# EAGLE design main_v2.0 (EAGLE 9.6.2)
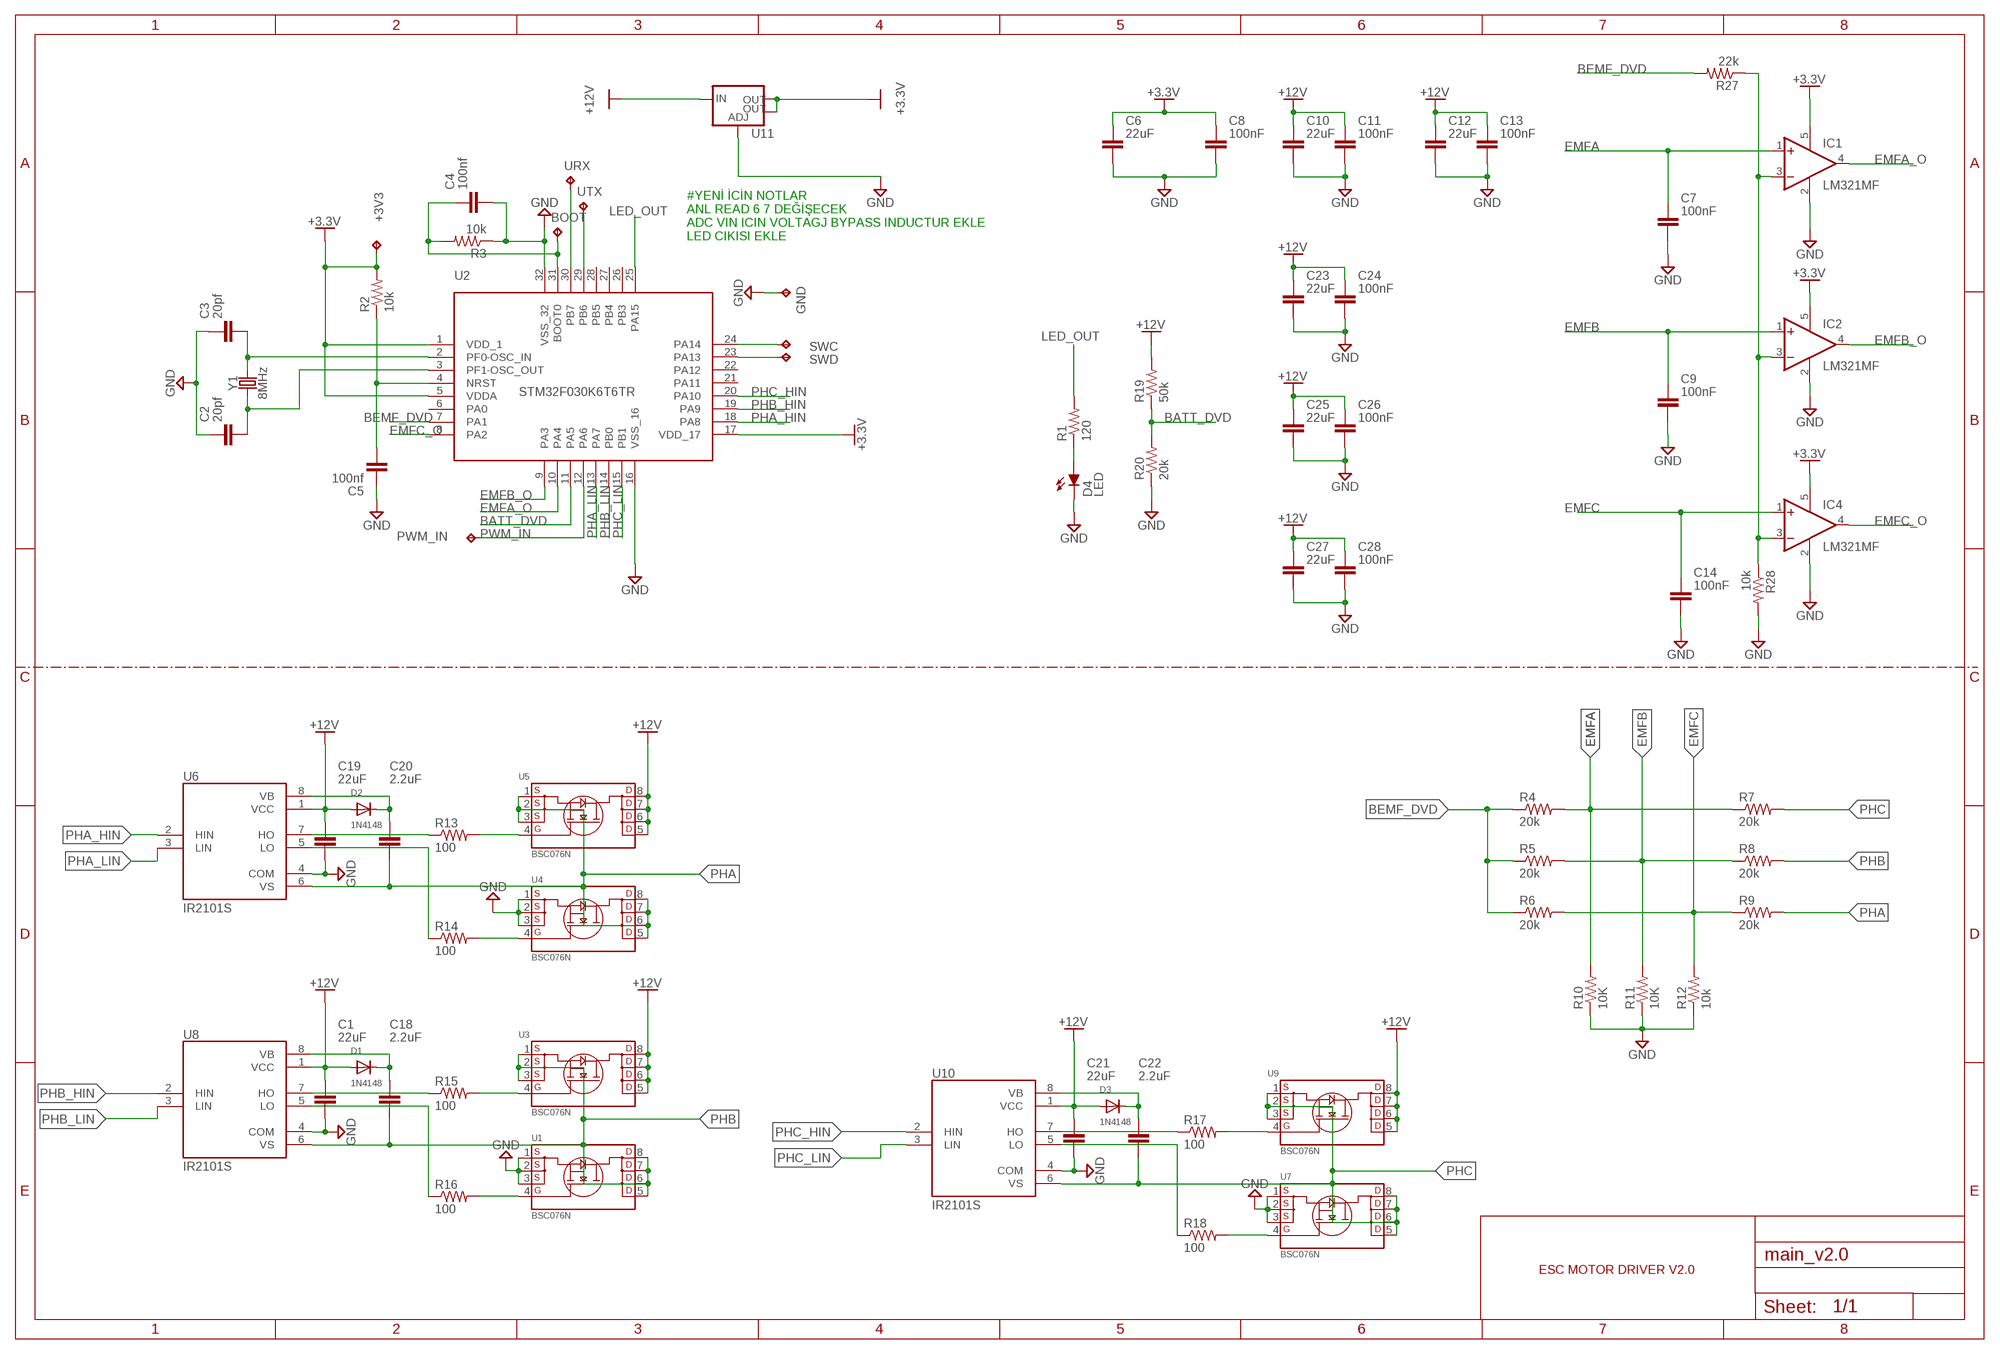
[diagram p0: schematic, sheet 1]

## Parts
+3V3  TPTP13R  [TP13R]
BOOT  TPTP13R  [TP13R]
C1  22uF  C_CHIP-1206(3216-METRIC)  [CAPC3216X135]
C2  20pf  C_CHIP-0603(1608-METRIC)  [CAPC1608X85]
C3  20pf  C_CHIP-0603(1608-METRIC)  [CAPC1608X85]
C4  100nf  C_CHIP-0805(2012-METRIC)  [CAPC2012X110]
C5  100nf  C_CHIP-0805(2012-METRIC)  [CAPC2012X110]
C6  22uF  C_CHIP-1206(3216-METRIC)  [CAPC3216X135]
C7  100nF  C_CHIP-0805(2012-METRIC)  [CAPC2012X110]
C8  100nF  C_CHIP-0805(2012-METRIC)  [CAPC2012X110]
C9  100nF  C_CHIP-0805(2012-METRIC)  [CAPC2012X110]
C10  22uF  C_CHIP-1206(3216-METRIC)  [CAPC3216X135]
C11  100nF  C_CHIP-0805(2012-METRIC)  [CAPC2012X110]
C12  22uF  C_CHIP-1206(3216-METRIC)  [CAPC3216X135]
C13  100nF  C_CHIP-0805(2012-METRIC)  [CAPC2012X110]
C14  100nF  C_CHIP-0805(2012-METRIC)  [CAPC2012X110]
C18  2.2uF  C_CHIP-1206(3216-METRIC)  [CAPC3216X135]
C19  22uF  C_CHIP-1206(3216-METRIC)  [CAPC3216X135]
C20  2.2uF  C_CHIP-1206(3216-METRIC)  [CAPC3216X135]
C21  22uF  C_CHIP-1206(3216-METRIC)  [CAPC3216X135]
C22  2.2uF  C_CHIP-1206(3216-METRIC)  [CAPC3216X135]
C23  22uF  C_CHIP-1206(3216-METRIC)  [CAPC3216X135]
C24  100nF  C_CHIP-0805(2012-METRIC)  [CAPC2012X110]
C25  22uF  C_CHIP-1206(3216-METRIC)  [CAPC3216X135]
C26  100nF  C_CHIP-0805(2012-METRIC)  [CAPC2012X110]
C27  22uF  C_CHIP-1206(3216-METRIC)  [CAPC3216X135]
C28  100nF  C_CHIP-0805(2012-METRIC)  [CAPC2012X110]
D1  1N4148  DIODESOD-323F  [SOD-323F]
D2  1N4148  DIODESOD-323F  [SOD-323F]
D3  1N4148  DIODESOD-323F  [SOD-323F]
D4  LED  LED_LEDCHIP-LED0603MP  [LED_CHIP-LED0603MP]
GND  TPTP13R  [TP13R]
IC1  LM321MF  [SOT23-5]
IC2  LM321MF  [SOT23-5]
IC4  LM321MF  [SOT23-5]
PWM_IN  TPTP13R  [TP13R]
R1  120  R-US_R0603  [R0603]
R2  10k  R-US_R0603  [R0603]
R3  10k  R-US_R0603  [R0603]
R4  20k  R-US_R0603  [R0603]
R5  20k  R-US_R0603  [R0603]
R6  20k  R-US_R0603  [R0603]
R7  20k  R-US_R0603  [R0603]
R8  20k  R-US_R0603  [R0603]
R9  20k  R-US_R0603  [R0603]
R10  10K  R-US_R0603  [R0603]
R11  10K  R-US_R0603  [R0603]
R12  10k  R-US_R0603  [R0603]
R13  100  R-US_R0603  [R0603]
R14  100  R-US_R0603  [R0603]
R15  100  R-US_R0603  [R0603]
R16  100  R-US_R0603  [R0603]
R17  100  R-US_R0603  [R0603]
R18  100  R-US_R0603  [R0603]
R19  50k  R-US_R0603  [R0603]
R20  20k  R-US_R0603  [R0603]
R27  22k  R-US_R0603  [R0603]
R28  10k  R-US_R0603  [R0603]
SWC  TPTP13R  [TP13R]
SWD  TPTP13R  [TP13R]
U1  BSC076N  [TRANS_BSC076N06NS3-G]
U2  STM32F030K6T6TR  [32-LQFP]
U3  BSC076N  [TRANS_BSC076N06NS3-G]
U4  BSC076N  [TRANS_BSC076N06NS3-G]
U5  BSC076N  [TRANS_BSC076N06NS3-G]
U6  IR2101S  [SOIC127P600X175-8N]
U7  BSC076N  [TRANS_BSC076N06NS3-G]
U8  IR2101S  [SOIC127P600X175-8N]
U9  BSC076N  [TRANS_BSC076N06NS3-G]
U10  IR2101S  [SOIC127P600X175-8N]
U11  V_REG_LM1117SOT223  [SOT223]
URX  TPTP13R  [TP13R]
UTX  TPTP13R  [TP13R]
Y1  8MHz  CRYSTAL-8MHZSMD-5X3.2  [CRYSTAL-SMD-5X3.2-4PAD]

## Nets
+3.3V: +3V3.TP C6.1 C8.1 IC1.5(V+) IC2.5(V+) IC4.5(V+) R2.2 U2.1(VDD_1) U2.5(VDDA) U2.17(VDD_17) U11.2(OUT) U11.4(OUT)
+12V [New Class]: C1.1 C10.1 C11.1 C12.1 C13.1 C19.1 C21.1 C23.1 C24.1 C25.1 C26.1 C27.1 C28.1 D1.A D2.A D3.A R19.2 U3.5(D1) U3.6(D2) U3.7(D3) U3.8(D4) U5.5(D1) U5.6(D2) U5.7(D3) U5.8(D4) U6.1(VCC) U8.1(VCC) U9.5(D1) U9.6(D2) U9.7(D3) U9.8(D4) U10.1(VCC) U11.3(IN)
BATT_DVD: R19.1 R20.2 U2.11(PA5)
BEMF_DVD: R4.1 R5.1 R6.1 R27.2 U2.7(PA1)
EMFA: C7.1 IC1.1(+IN) R4.2 R7.1 R10.2
EMFA_O: IC1.4(OUT) U2.10(PA4)
EMFB: C9.1 IC2.1(+IN) R5.2 R8.1 R11.2
EMFB_O: IC2.4(OUT) U2.9(PA3)
EMFC: C14.1 IC4.1(+IN) R6.2 R9.1 R12.2
EMFC_O: IC4.4(OUT) U2.8(PA2)
GND [New Class]: C1.2 C2.1 C3.1 C4.2 C5.1 C6.2 C7.2 C8.2 C9.2 C10.2 C11.2 C12.2 C13.2 C14.2 C19.2 C21.2 C23.2 C24.2 C25.2 C26.2 C27.2 C28.2 D4.C GND.TP IC1.2(V-) IC2.2(V-) IC4.2(V-) R3.1 R10.1 R11.1 R12.1 R20.1 R28.2 U1.1(S1) U1.2(S2) U1.3(S3) U2.16(VSS_16) U2.32(VSS_32) U4.1(S1) U4.2(S2) U4.3(S3) U6.4(COM) U7.1(S1) U7.2(S2) U7.3(S3) U8.4(COM) U10.4(COM) U11.1(ADJ)
LED_OUT: R1.2 U2.25(PA15)
N$1: C2.2 U2.3(PF1-OSC_OUT) Y1.1
N$2: C3.2 U2.2(PF0-OSC_IN) Y1.3
N$3: U2.30(PB7) URX.TP
N$4: C5.2 R2.1 U2.4(NRST)
N$5: BOOT.TP C4.1 R3.2 U2.31(BOOT0)
N$6: U2.29(PB6) UTX.TP
N$7: IC1.3(-IN) IC2.3(-IN) IC4.3(-IN) R27.1 R28.1
N$8: SWC.TP U2.24(PA14)
N$9: SWD.TP U2.23(PA13)
N$10: D4.A R1.1
N$15: R15.1 U8.7(HO)
N$16: R16.1 U8.5(LO)
N$17: R15.2 U3.4(G)
N$18: C18.1 D1.C U8.8(VB)
N$20: R16.2 U1.4(G)
N$21: R13.1 U6.7(HO)
N$22: R14.1 U6.5(LO)
N$23: C20.1 D2.C U6.8(VB)
N$26: R14.2 U4.4(G)
N$28: R13.2 U5.4(G)
N$29: R17.1 U10.7(HO)
N$30: R18.1 U10.5(LO)
N$31: C22.1 D3.C U10.8(VB)
N$33: R18.2 U7.4(G)
N$35: R17.2 U9.4(G)
PHA: C20.2 R9.2 U4.5(D1) U4.6(D2) U4.7(D3) U4.8(D4) U5.1(S1) U5.2(S2) U5.3(S3) U6.6(VS)
PHA_HIN: U2.18(PA8) U6.2(HIN)
PHA_LIN: U2.13(PA7) U6.3(LIN)
PHB: C18.2 R8.2 U1.5(D1) U1.6(D2) U1.7(D3) U1.8(D4) U3.1(S1) U3.2(S2) U3.3(S3) U8.6(VS)
PHB_HIN: U2.19(PA9) U8.2(HIN)
PHB_LIN: U2.14(PB0) U8.3(LIN)
PHC: C22.2 R7.2 U7.5(D1) U7.6(D2) U7.7(D3) U7.8(D4) U9.1(S1) U9.2(S2) U9.3(S3) U10.6(VS)
PHC_HIN: U2.20(PA10) U10.2(HIN)
PHC_LIN: U2.15(PB1) U10.3(LIN)
PWM_IN: PWM_IN.TP U2.12(PA6)
Unconnected: U2.6(PA0) U2.21(PA11) U2.22(PA12) U2.26(PB3) U2.27(PB4) U2.28(PB5)

## Notes on the sheet
- #YENİ İCİN NOTLAR
  ANL READ 6 7 DEĞİŞECEK
  ADC VIN ICIN VOLTAGJ BYPASS INDUCTUR EKLE
  LED CIKISI EKLE
- ESC MOTOR DRIVER V2.0

## Library data of the parts
+3V3 BOOT GND PWM_IN SWC SWD URX UTX = BeagleBone_Blue_R3:TP: Test pad
C1-C14 C18-C28 = Capacitor:C: Capacitor - Generic; CATEGORY: Capacitor
D1-D3 = adafruit:DIODE: Diode SMADIODE - SMA Surface Mount Package 20V 1A Schottky Diode Digikey: 641-1014-6-ND DO-1N4148 - Through Hole Small Current Diode SOD-123 20V 1 A (.5mV Vf) Schottky Diode - Digikey: MBRX120TPMSCT-ND SOD-323 10V 570mA (.38mV Vf, 3ns) Schottky Diode - Digikey: ZLLS410CT-ND SOD-523 30V 30mA Schottky Diode (RB751S-40TE61) - Digikey: RB751S-40TE61CT-ND SOT23-R/W - SOT23 Package (R = Solder Paste/Reflow Ovens, W = Hand-Soldering) BAT54Film 40V 300mA - Digikey: 497-7162-1-ND
D4 = 52101-101-REV-A_v16:LED_LED: LED Various Types
IC1 IC2 IC4 = linear:LM321?*: Low Power Single Op Amp Source: http://cache.national.com/ds/LM/LM321.pdf
R1-R20 R27 R28 = rcl:R-US_: RESISTOR, American symbol; SPICEPREFIX: R
U1 U3-U5 U7 U9 = BSC076N06NS3-G:BSC076N: BSC076N
U2 = Microcontroller:STM32F030K6T6TR: IC MCU 32BIT 32KB FLASH 32LQFP Manufacturer's datasheet <https://www.st.com/content/ccc/resource/technical/document/datasheet/a4/5d/0b/0e/87/c4/4d/71/DM00088500.pdf/files/DM00088500.pdf/jcr:content/translations/en.DM00088500.pdf>; CREATED_BY: PCBLayout.com; DIGIKEY_PART_NUMBER: 497-17334-6-ND; MANUFACTURER: STMicroelectronics; MPN: STM32F030K6T6TR; PACKAGE: 32-LQFP
U6 U8 U10 = IR2101S:IR2101S: Half-Bridge Gate Driver IC Non-Inverting 8-SOIC Check availability <https://pricing.snapeda.com/parts/IR2101S/Infineon%20Technologies/view-part?ref=eda>; AVAILABILITY: In Stock; DESCRIPTION: Half-Bridge Gate Driver IC Non-Inverting 8-SOIC; MF: Infineon Technologies; MP: IR2101S; PACKAGE: SOIC-8 Infineon; PRICE: None; PURCHASE-URL: https://pricing.snapeda.com/search/part/IR2101S/?ref=eda
U11 = SparkFun-IC-Power:V_REG_LM1117: Voltage Regulator LM1117 Standard adjustable voltage regulator but in SMD form. Spark Fun Electronics SKU : COM-00595; PROD_ID: VREG-08170
Y1 = SparkFun-Clocks:CRYSTAL-8MHZ: 8MHz Crystal Datasheet Example <http://www.futureelectronics.com/en/technologies/electromechanical/timing-devices/crystals/Pages/6008189-ABM3B-8.000MHZ-B2-T.aspx?IM=0> Frequency: 8MHz Frequency Tolerance: ±20ppm Load Capacitance: 18pF SparkFun Products: Pro Micro -3.3V/8MHz <https://www.sparkfun.com/products/12587> WAV Trigger <https://www.sparkfun.com/products/13660>; PROD_ID: XTAL-09431

## Board
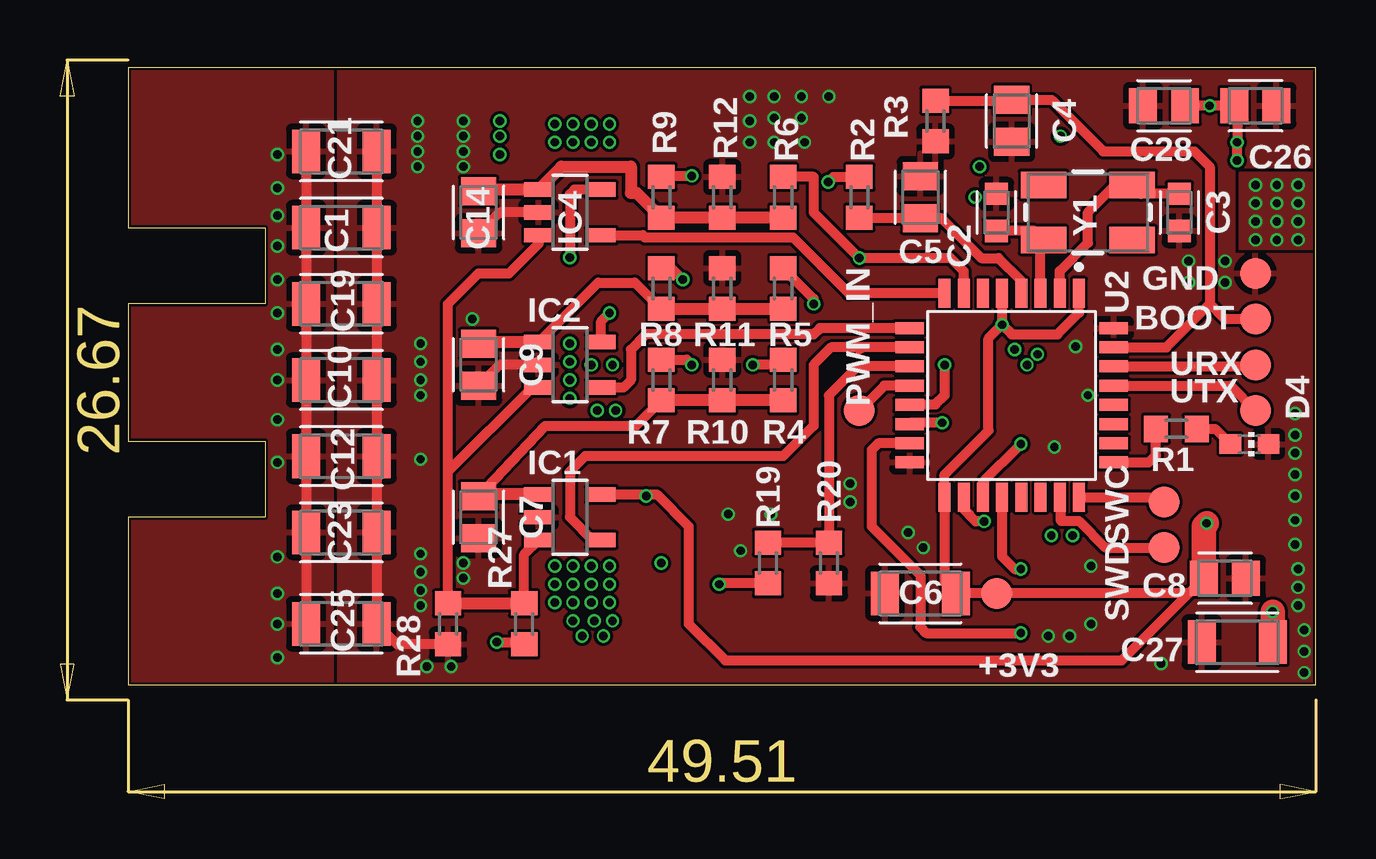
[diagram p1: board, top side]
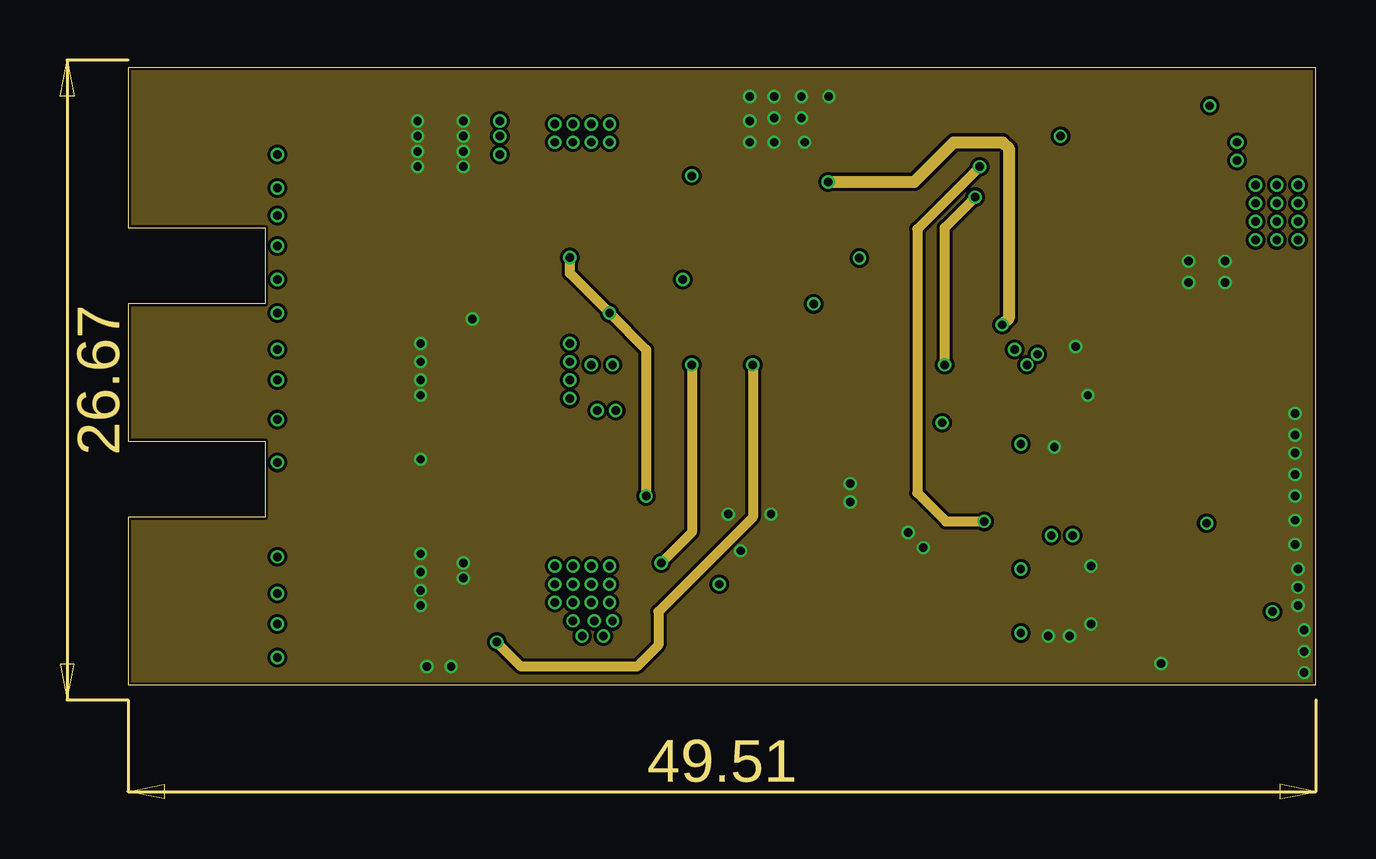
[diagram p2: board, inner layer Route2]
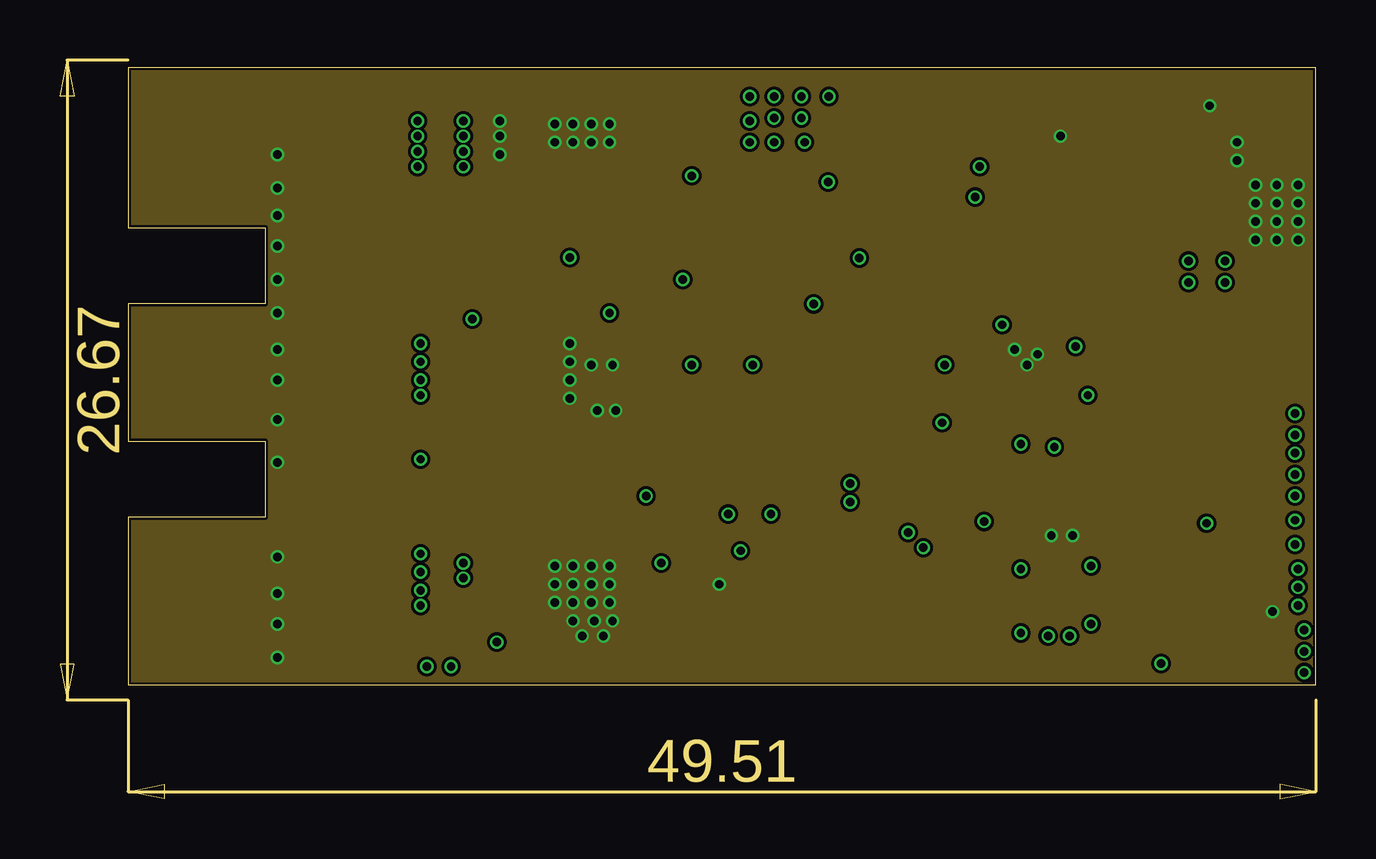
[diagram p3: board, inner layer Route15]
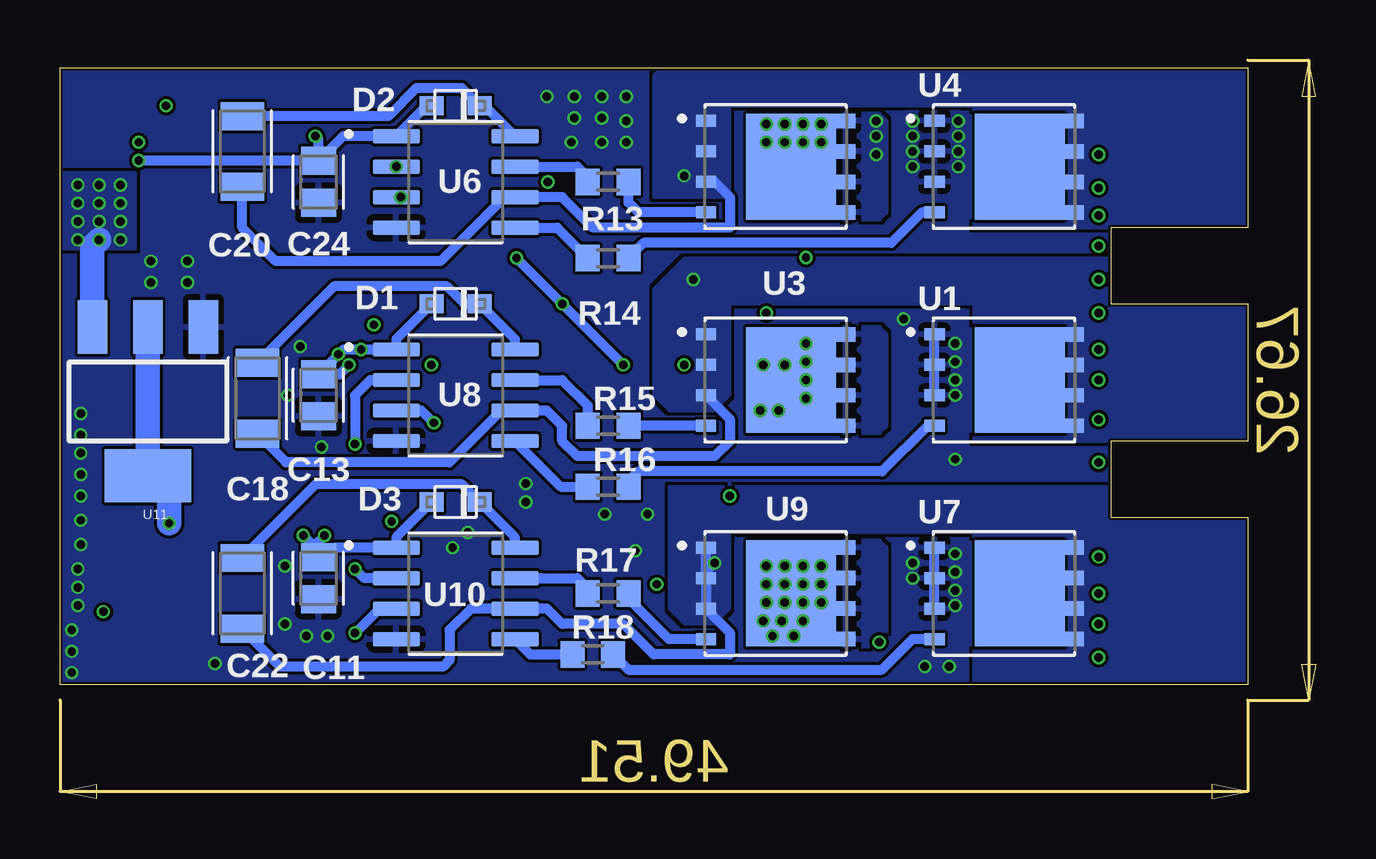
[diagram p4: board, bottom side, seen from below]

Size 49.51 x 25.7 mm. Coordinates in mm from the lower left corner, seen from the top.
Outline: 0,0 49.51,0 49.51,25.7 0,25.7 0,19.05 5.71,19.05 5.71,15.88 0,15.88 0,10.16 5.71,10.16 5.71,6.98 0,6.98 0,0
Copper layers (1*2*15*16): Top 0.035559375mm / dielectric 0.17018125mm / Route2 0.01778125mm / dielectric 47mil / Route15 0.01778125mm / dielectric 0.17018125mm / Bottom 0.035559375mm
Design rules "jlcpcb-4-layer": minimum track width 5mil, minimum drill 0.2mm, track to track 0.126490625mm, track to pad 0.126490625mm, pad to pad 0.126490625mm, via to via 0.126490625mm, smd to smd 0mil, copper to edge 0.1mm, drill to drill 5mil, minimum pad ring 4mil, minimum via ring 4mil, stop-mask expansion 3mil, vias tented up to drill 100mil, thermal gap 10mil

### Footprints (pad centres in the part's own frame; a part is rotated, then mirrored left to right if it is on the bottom)
TP13R = smd 1.3 x 1.3: TP 0,0
CAPC3216X135 = smd 1.165 x 1.815: 1 -1.475,0; 2 1.475,0
CAPC1608X85 = smd 0.921 x 0.97: 1 -0.775,0; 2 0.775,0
CAPC2012X110 = smd 1.165 x 1.465: 1 -0.875,0; 2 0.875,0
SOD-323F = smd 1 x 0.8: A -1,0; C 1,0
LED_CHIP-LED0603MP = smd 0.8 x 0.9: A 0,-0.794; C 0,0.794
SOT23-5 = smd 0.6 x 1.2: 1 -0.95,-1.306; 2 0,-1.306; 3 0.95,-1.306; 4 0.95,1.306; 5 -0.95,1.306
R0603 = smd 1 x 1.1: 1 -0.85,0; 2 0.85,0
TRANS_BSC076N06NS3-G = smd 0.85 x 0.5: 1 -2.9,1.905; 2 -2.9,0.635; 3 -2.9,-0.635; 4 -2.9,-1.905 | smd 0.8 x 0.6: 5 2.925,-1.905; 6 2.925,-0.635; 7 2.925,0.635; 8 2.925,1.905 | smd 3.75 x 4.41: 9 0.65,0
32-LQFP = smd 1.2 x 0.5: 1 -4.25,2.8; 2 -4.25,2; 3 -4.25,1.2; 4 -4.25,0.4; 5 -4.25,-0.4; 6 -4.25,-1.2; 7 -4.25,-2; 8 -4.25,-2.8; 17 4.25,-2.8; 18 4.25,-2; 19 4.25,-1.2; 20 4.25,-0.4; 21 4.25,0.4; 22 4.25,1.2; 23 4.25,2; 24 4.25,2.8 | smd 0.5 x 1.2: 9 -2.8,-4.25; 10 -2,-4.25; 11 -1.2,-4.25; 12 -0.4,-4.25; 13 0.4,-4.25; 14 1.2,-4.25; 15 2,-4.25; 16 2.8,-4.25; 25 2.8,4.25; 26 2,4.25; 27 1.2,4.25; 28 0.4,4.25; 29 -0.4,4.25; 30 -1.2,4.25; 31 -2,4.25; 32 -2.8,4.25
SOIC127P600X175-8N = smd 1.97 x 0.6: 1 -2.475,1.905; 2 -2.475,0.635; 3 -2.475,-0.635; 4 -2.475,-1.905; 5 2.475,-1.905; 6 2.475,-0.635; 7 2.475,0.635; 8 2.475,1.905
SOT223 = smd 1.219 x 2.235: 1 -2.311,-3.099; 2 0,-3.099; 3 2.311,-3.099 | smd 3.6 x 2.2: 4 0,3.099
CRYSTAL-SMD-5X3.2-4PAD = smd 1.9 x 1.1: 1 -1.85,-1.15; 2 1.85,-1.15; 3 1.85,1.15; 4 -1.85,1.15

### Placement (x,y rotation side)
+3V3  36.2,3.81 0 top
BOOT  46.99,15.24 0 top
C1  8.89,19.05 0 top
C2  36.2,19.69 270 top
C3  43.81,19.69 90 top
C4  36.83,23.5 270 top
C5  33.02,20.32 270 top
C6  33.02,3.81 180 top
C7  14.61,6.98 270 top
C8  45.72,4.44 0 top
C9  14.61,13.33 270 top
C10  8.89,12.7 0 top
C11  38.73,4.44 270 bottom
C12  8.89,9.52 0 top
C13  38.73,12.06 270 bottom
C14  14.61,19.69 270 top
C18  41.27,11.94 270 bottom
C19  8.89,15.88 0 top
C20  41.91,22.22 270 bottom
C21  8.89,22.22 0 top
C22  41.91,3.81 270 bottom
C23  8.89,6.35 0 top
C24  38.73,20.95 270 bottom
C25  8.89,2.54 0 top
C26  46.99,24.13 0 top
C27  46.23,1.78 180 top
C28  43.18,24.13 180 top
D1  33.02,15.88 0 bottom
D2  33.02,24.13 0 bottom
D3  33.02,7.62 0 bottom
D4  46.74,10.03 270 top
GND  46.99,17.14 0 top
IC1  18.41,6.98 270 top
IC2  18.41,13.33 270 top
IC4  18.41,19.69 270 top
PWM_IN  30.48,11.43 0 top
R1  43.69,10.67 180 top
R2  30.48,20.32 90 top
R3  33.66,23.5 90 top
R4  27.3,12.7 270 top
R5  27.3,16.51 270 top
R6  27.3,20.32 270 top
R7  22.23,12.7 90 top
R8  22.23,16.51 90 top
R9  22.23,20.32 90 top
R10  24.77,12.7 270 top
R11  24.77,16.51 270 top
R12  24.77,20.32 270 top
R13  26.67,20.95 0 bottom
R14  26.67,17.78 0 bottom
R15  26.67,10.8 0 bottom
R16  26.67,8.25 0 bottom
R17  26.67,3.81 0 bottom
R18  27.3,1.27 0 bottom
R19  26.67,5.08 270 top
R20  29.21,5.08 90 top
R27  16.51,2.54 270 top
R28  13.34,2.54 270 top
SWC  43.18,7.62 0 top
SWD  43.18,5.72 0 top
U1  10.16,12.7 0 bottom
U2  36.83,12.06 270 top
U3  19.68,12.7 0 bottom
U4  10.16,21.59 0 bottom
U5  19.68,21.59 0 bottom
U6  33.02,20.95 0 bottom
U7  10.16,3.81 0 bottom
U8  33.02,12.06 0 bottom
U9  19.68,3.81 0 bottom
U10  33.02,3.81 0 bottom
U11  45.85,11.81 180 bottom
URX  46.99,13.33 0 top
UTX  46.99,11.43 0 top
Y1  40.01,19.69 0 top

### Tracks (layer width: path | path; a pad name or v marks a point on that pad's centre or on a via)
+3.3V  (via drill 0.35)
  Top 0.127: v21.59,7.87 19.78,7.87 IC1.5
  Top 0.406: v36.43,15 36.83,14.61 38.73,14.61 39.63,15.5 U2.1 | v36.43,15 35.86,14.43 35.86,10.59 34.03,8.76 U2.17 34.03,4.27 C6.1 +3V3.TP 44.21,3.81 | 45.1,4.7 C8.1 44.21,3.81 | U2.5 v36.43,15 | v29.18,20.95 29.4,21.17 R2.2 | IC4.5 18.6,20.64 18.41,20.45 v18.41,17.81 | IC1.5 22.04,7.94 23.37,6.6 23.37,2.54 24.89,1.02 41.42,1.02 44.21,3.81 | IC2.5 19.72,15.15 v20.07,15.49
  Top 1.016: C8.1 44.84,6.62 v44.96,6.73
  Route2 0.406: v18.41,17.81 18.41,17.14 v20.07,15.49 21.59,13.97 v21.59,7.87
  Route2 0.508: v29.18,20.95 32.77,20.95 34.42,22.61 36.45,22.61 36.7,22.35 36.7,15.28 v36.43,15
  Bottom 1.016: v44.96,6.73 44.96,7.82 U11.4 U11.2
+12V  (via drill 0.35)
  Top 0.406: C21.1 C25.1 | v46.23,21.84 v46.23,22.61 46.23,24.02 C26.1 v45.09,24.13 C28.1 | R19.2 24.68,4.23 v24.64,4.19
  Top 1.016: C27.1 v47.7,3.05
  Bottom 0.406: D2.A 34.23,24.13 U6.1 37.7,22.86 C24.1 | D3.A 35.49,6.14 U10.1 38.03,5.72 38.58,5.17 C11.1 | D1.A 35.49,14.4 U8.1 v36.96,13.97 37.7,13.97 v37.9,13.77 C13.1 37.86,12.94 v37.47,13.33 | C24.1 46.21,21.83 v46.23,21.84 | C11.1 38.73,5.97 v38.48,6.22 | C11.1 38.73,5.59 v39.37,6.22 | C24.1 38.73,22.73 v38.86,22.86 | v18.41,13.46 18.29,13.33 U3.7 | v17.78,3.43 17.53,3.17 U9.6
  Bottom 1.016: U11.3 48.16,18.26 v47.88,18.54
  other vias: 15.49,22.1 15.49,22.86 15.49,23.5 17.78,23.37 18.54,23.37 19.3,23.37 20.07,23.37 20.07,22.61 19.3,22.61 18.54,22.61 17.78,22.61 18.41,14.22 18.41,12.7 18.41,11.94 20.32,11.43 19.56,11.43 17.78,4.95 18.54,4.95 19.3,4.95 20.07,4.95 20.07,4.19 19.3,4.19 18.54,4.19 17.78,4.19 18.54,3.43 19.3,3.43 20.07,3.43 18.54,2.67 19.43,2.67 20.19,2.67 18.92,2.03 19.81,2.03 20.19,13.33 19.3,13.33 6.22,22.1 6.22,20.7 6.22,19.56 6.22,18.29 6.22,16.89 6.22,15.49 6.22,13.97 6.22,12.7 6.22,11.05 6.22,9.27 6.22,5.33 6.22,3.81 6.22,2.54 6.22,1.14 46.99,20.83 47.88,20.83 48.77,20.83 47.88,20.07 48.77,20.07 46.99,20.07 46.99,19.3 47.88,19.3 48.77,19.3 48.77,18.54 46.99,18.54
  pour Route15: -0.64,26.67 50.16,26.67 50.16,-1.91 -1.27,-1.91 -1.27,26.67
  pour Bottom: 15.62,5.97 20.95,5.97 20.95,1.65 15.37,1.65 15.11,1.91 15.11,5.72 15.37,5.97
  pour Bottom: 15.62,14.86 20.95,14.86 20.95,10.54 15.37,10.54 15.11,10.8 15.11,14.61 15.37,14.86
  pour Bottom: 15.62,23.75 20.95,23.75 20.95,19.43 15.37,19.43 15.11,19.69 15.11,23.5 15.37,23.75
  pour Top: -0.13,25.91 8.51,25.91 8.51,0 -0.13,0
  pour Bottom: 46.35,21.34 49.4,21.34 49.4,18.16 46.35,18.16
  pour Top: 46.35,21.34 49.4,21.34 49.4,18.16 46.35,18.16
BATT_DVD
  Top 0.406: U2.11 30.41,13.27 29.21,12.06 R20.2 R19.1
BEMF_DVD  (via drill 0.35)
  Top 0.406: 27.73,21.17 R6.1 28.57,21.17 28.57,19.69 v30.48,17.78 34.29,17.78 34.83,17.24 U2.7 | R4.1 27.09,13.33 v26.04,13.33 | v28.57,15.88 28.57,16.09 R5.1 | v15.37,1.78 16.42,1.78 R27.2
  Route2 0.406: v26.04,13.33 26.04,6.98 22.1,3.05 22.1,1.65 21.21,0.76 16.38,0.76 v15.37,1.78
  Bottom 0.406: v26.04,13.33 v28.57,15.88 v30.48,17.78
EMFA
  Top 0.406: C7.1 17.39,10.8 21.17,10.8 R7.1 | R10.2 R4.2
  Top 0.508: R4.2 R7.1 | IC1.1 15.16,7.94 C7.1
EMFA_O
  Top 0.406: U2.10 30.57,14.06 | 30.57,14.06 30.48,13.97 | 30.57,14.06 29.3,14.06 28.57,13.33 28.57,10.8 27.3,9.52 19.05,9.52 18.41,8.89 18.41,6.98 19.36,6.03 IC1.4
EMFB
  Top 0.406: R8.1 21.12,16.76 19.59,16.76 IC2.1
  Top 0.508: R5.2 R11.2 R8.1 | IC2.1 15.16,14.28 C9.1
EMFB_O
  Top 0.406: IC2.4 20.64,12.39 20.95,12.7 20.95,13.97 21.59,14.61 28.57,14.61 28.84,14.86 U2.9 32.12,14.86
EMFC
  Top 0.508: R6.2 R12.2 R9.1 21.21,20.49 20.95,20.49 20.95,21.59 18.06,21.59 IC4.1 15.16,20.64 C14.1
EMFC_O
  Top 0.406: IC4.4 21.44,18.73 21.54,18.64 27.71,18.64 30.04,16.31 U2.8
GND  (via drill 0.35)
  Top 0.406: C21.2 C1.2 C12.2 C25.2 11.21,1.69 R28.2 | C14.2 15.44,19.65 15.47,19.65 15.51,19.69 IC4.2 | C9.2 15.44,13.3 15.47,13.3 15.51,13.33 IC2.2
  Bottom 0.406: U1.3 U1.1 | U7.3 U7.1
  other vias: 13.97,21.59 13.97,22.22 13.97,22.86 13.97,23.5 12.06,23.5 12.06,22.86 12.06,22.22 12.06,21.59 12.19,14.22 12.19,13.46 12.19,12.7 12.19,12.06 12.19,5.46 12.19,4.7 12.19,3.94 12.19,3.3 13.97,5.08 13.97,4.44 14.35,15.24 12.19,9.4 12.45,0.76 13.46,0.76 25.02,7.11 25.53,5.59 26.8,7.11 45.72,17.65 45.72,16.76 44.2,16.76 44.2,17.65 48.64,11.3 48.64,10.41 48.64,9.65 48.77,4.83 48.77,4.06 48.77,3.3 43.05,0.89 38.35,2.03 39.24,2.03 40.13,2.54 40.13,4.95 32.51,6.35 33.15,5.72 25.91,24.51 26.92,24.51 28.07,24.51 29.21,24.51 26.92,23.62 28.07,23.62 26.92,22.61 25.91,22.61 25.91,23.5 28.19,22.61 39.5,14.1 38.61,9.91 40.01,12.06 30.1,8.38 30.1,7.62 48.64,8.76 48.64,7.87 48.64,6.86 48.64,5.84 49.02,2.29 49.02,1.4 49.02,0.51
  pour Route2: -0.64,26.03 50.16,26.03 50.16,-0.64 -0.64,-0.64
  pour Top (rank 3): -0.64,26.03 50.16,26.03 50.16,-0.64 -0.64,-0.64
  pour Bottom: 11.94,23.88 14.22,23.88 14.35,23.75 14.35,21.08 13.97,20.7 11.94,20.7 11.68,20.95 11.68,21.08 11.68,23.62
  pour Bottom: 12.06,14.86 14.35,14.86 14.48,14.73 14.48,12.06 14.1,11.68 12.06,11.68 11.81,11.94 11.81,12.06 11.81,14.61
  pour Bottom: 12.06,5.97 14.35,5.97 14.48,5.84 14.48,3.17 14.1,2.79 12.06,2.79 11.81,3.05 11.81,3.17 11.81,5.72
  pour Bottom (rank 6): 50.42,26.92 50.42,-1.02 -1.02,-1.02 -1.02,26.92
LED_OUT
  Top 0.406: U2.25 42.54,9.27 42.84,9.56 R1.2
N$1
  Top 0.406: U2.3 38.03,18.41 Y1.1 37.78,18.91 C2.2
N$2
  Top 0.406: C3.2 42.23,20.46 Y1.3 41.16,20.83 40.01,19.69 40.01,18.41 38.83,17.24 U2.2
N$3
  Top 0.406: U2.30 46.92,13.27 URX.TP
N$4
  Top 0.406: 33.26,19.71 C5.2 | U2.4 37.23,16.83 36.28,17.78 35.56,17.78 33.9,19.44 C5.2 | C5.2 30.5,19.44 R2.1
N$5
  Top 0.406: R3.2 36.8,24.34 C4.1 38.49,24.37 40.64,22.22 44.45,22.22 45.09,21.59 45.09,15.88 | BOOT.TP 45.72,15.24 45.09,15.88 | U2.31 43.27,14.06 45.09,15.88
N$6
  Top 0.406: U2.29 45.95,12.47 UTX.TP
N$7
  Top 0.406: R27.1 16.51,5.44 IC1.3 | R28.1 13.34,8.89 | IC2.3 16.83,12.39 13.34,8.89 | 13.34,8.89 13.34,15.88 14.61,17.14 15.88,17.14 17.11,18.38 IC4.3
  Top 0.508: R28.1 R27.1
N$8
  Top 0.406: U2.24 42.98,7.81 SWC.TP
N$9
  Top 0.406: U2.23 38.86,7.78 38.86,6.86 38.89,6.83 39.62,6.83 40.73,5.72 SWD.TP
N$10
  Top 0.406: R1.1 45.31,10.67 D4.A
N$15
  Bottom 0.406: U8.7 28.57,12.7 27.52,11.64 R15.1
N$16
  Bottom 0.406: U8.5 28.64,8.25 R16.1
N$17
  Bottom 0.406: U3.4 R15.2
N$18
  Bottom 0.406: U8.8 30.55,14.4 D1.C 32.65,15.88 33.38,16.61 38.08,16.61 C18.1
N$20
  Bottom 0.406: U1.4 13.34,10.8 15.24,8.89 25.4,8.89 25.82,8.47 R16.2
N$21
  Bottom 0.406: U6.7 27.94,21.59 27.52,21.17 R13.1
N$22
  Bottom 0.406: R14.1 28.79,19.05 U6.5
N$23
  Bottom 0.406: U6.8 31.82,24.13 D2.C 32.75,24.86 34.66,24.86 35.82,23.7 C20.1
N$26
  Bottom 0.406: U4.4 13.59,19.69 14.86,18.41 25.18,18.41 R14.2
N$28
  Bottom 0.406: U5.4 25.4,19.69 25.82,20.11 R13.2
N$29
  Bottom 0.406: 29.43,4.44 U10.7 27.94,4.44 27.65,4.15 27.65,3.94 R17.1
N$30
  Bottom 0.406: U10.5 29.91,1.27 R18.1
N$31
  Bottom 0.406: U10.8 30.55,6.14 D3.C 32.75,8.35 38.85,8.35 C22.1
N$33
  Bottom 0.406: R18.2 25.82,0.64 15.24,0.64 13.97,1.91 U7.4
N$35
  Bottom 0.406: U9.4 24.13,1.91 25.82,3.59 R17.2
PHA  (via drill 0.35)
  Top 0.406: R9.2 22.26,21.21 v23.5,21.21
  Bottom 0.406: U5.3 22.23,20.95 21.59,20.32 21.59,19.05 27.3,19.05 28.57,20.32 U6.6 30.99,20.32 33.66,17.65 40.51,17.65 41.91,19.05 C20.2
  pour Bottom (no thermals): 11.43,24.13 11.43,19.05 -0.64,19.05 -0.64,26.67 23.5,26.67 24.77,25.4 24.77,20.32 21.59,20.32 21.59,24.13
PHA_HIN  (via drill 0.35)
  Top 0.406: v35.69,6.81 35.32,6.81 35.05,7.08 35.05,7.11 34.8,7.37 34.8,7.78 U2.18
  Route2 0.406: v35.49,21.59 32.89,18.99 32.89,8 34.08,6.81 v35.69,6.81
PHA_LIN  (via drill 0.35)
  Top 0.406: U2.13 32.6,11.68 33.66,11.68 34.04,12.06 v34.04,13.33
  Route2 0.406: v34.04,13.33 34.04,19.05 v35.31,20.32
  Bottom 0.406: U6.3 v35.31,20.32
PHB  (via drill 0.35)
  Top 0.406: R8.2 22.64,17.36 v23.11,16.89
  Bottom 0.406: U3.3 21.59,11.07 21.59,10.16 22.23,9.52 27.94,9.52 28.57,10.16 28.57,10.8 29.21,11.43 U8.6 31.11,11.43 33.27,9.27 40.08,9.27 C18.2
  pour Bottom (no thermals): -0.64,17.78 23.5,17.78 24.77,16.51 24.77,12.06 24.13,11.43 22.23,11.43 21.59,12.06 21.59,15.88 11.43,15.88 11.43,10.16 -0.64,10.16
PHB_HIN  (via drill 0.35)
  Top 0.406: U2.19 35.63,8.45 v37.21,10.03
  Bottom 0.406: U8.2 36.58,12.7 37.21,12.06 v37.21,10.03
PHB_LIN  (via drill 0.35)
  Top 0.406: v33.93,10.92 32.64,10.92 U2.14
  Bottom 0.406: U8.3 34.44,11.43 v33.93,10.92
PHC  (via drill 0.35)
  Top 0.406: R7.2 23.28,13.55 v23.5,13.33
  Route2 0.406: v22.23,5.08 23.5,6.35 v23.5,13.33
  Bottom 0.406: C22.2 40.34,0.76 33.53,0.76 33.27,1.02 33.27,2.29 32.38,3.17 U10.6 29.21,3.17 28.57,2.54 26.04,2.54 24.77,1.27 21.59,1.27 21.59,2.18 U9.3 U9.2 | v22.23,5.08 22.59,4.72 U9.2 | U9.2 U9.1
  pour Bottom (no thermals): 11.43,6.35 11.43,0 0,0 0,6.98 5.71,6.98 5.71,8.25 24.13,8.25 24.13,3.17 23.5,2.54 22.23,2.54 21.59,3.17 21.59,6.35
PHC_HIN  (via drill 0.35)
  Top 0.406: U2.20 36.43,5.35 36.96,4.83 v37.21,4.83
  Bottom 0.406: U10.2 36.83,4.44 v37.21,4.83
PHC_LIN  (via drill 0.35)
  Top 0.406: U2.15 31.27,10.06 30.99,9.78 30.99,6.6 33.02,4.57 33.02,2.41 33.27,2.16 v37.21,2.16
  Bottom 0.406: U10.3 36.2,3.17 v37.21,2.16
PWM_IN
  Top 0.406: 30.25,11.66 PWM_IN.TP 31.52,12.47 U2.12